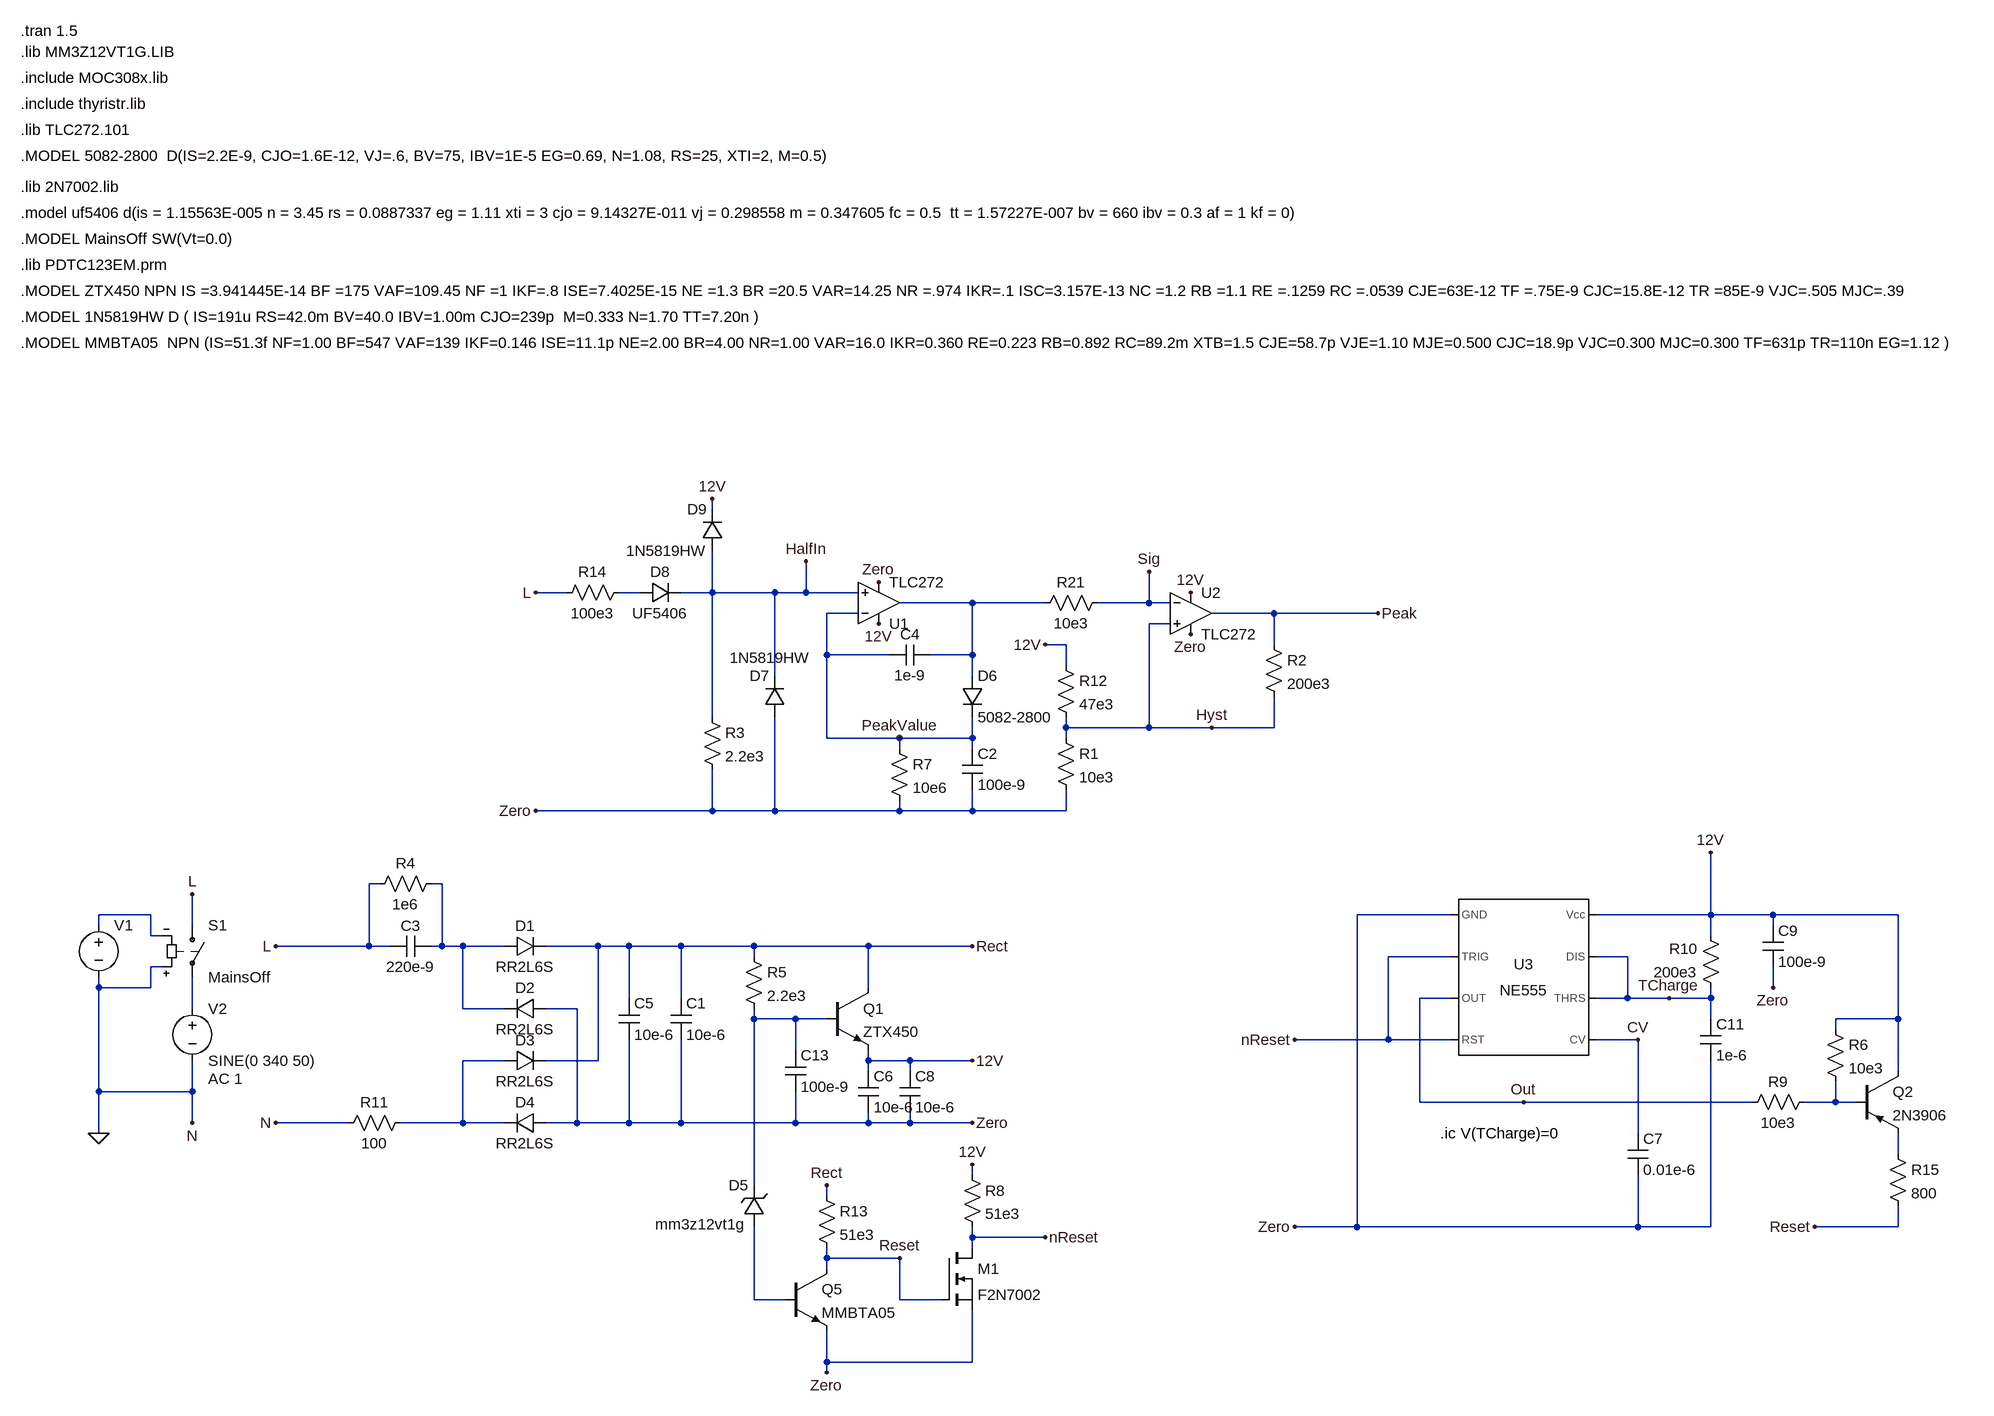
[diagram p0: schematic InrushTimer-3.asc]
InrushTimer-3.asc, the LTspice schematic file:
Version 4
SHEET 1 2412 1284
WIRE -1104 -656 -1104 -672
WIRE -1328 -528 -1376 -528
WIRE -1216 -528 -1248 -528
WIRE -1104 -528 -1104 -592
WIRE -1104 -528 -1152 -528
WIRE -1008 -528 -1104 -528
WIRE -960 -528 -960 -576
WIRE -960 -528 -1008 -528
WIRE -880 -528 -960 -528
WIRE -704 -512 -816 -512
WIRE -592 -512 -704 -512
WIRE -432 -512 -432 -560
WIRE -432 -512 -512 -512
WIRE -400 -512 -432 -512
WIRE -880 -496 -928 -496
WIRE -240 -496 -336 -496
WIRE -80 -496 -240 -496
WIRE -400 -480 -432 -480
WIRE -560 -448 -592 -448
WIRE -240 -448 -240 -496
WIRE -928 -432 -928 -496
WIRE -832 -432 -928 -432
WIRE -704 -432 -704 -512
WIRE -704 -432 -768 -432
WIRE -560 -416 -560 -448
WIRE -1008 -400 -1008 -528
WIRE -704 -400 -704 -432
WIRE -1104 -336 -1104 -528
WIRE -560 -320 -560 -336
WIRE -432 -320 -432 -480
WIRE -432 -320 -560 -320
WIRE -336 -320 -432 -320
WIRE -240 -320 -240 -368
WIRE -240 -320 -336 -320
WIRE -928 -304 -928 -432
WIRE -816 -304 -928 -304
WIRE -704 -304 -704 -336
WIRE -704 -304 -816 -304
WIRE -560 -304 -560 -320
WIRE -816 -288 -816 -304
WIRE -704 -288 -704 -304
WIRE -1104 -192 -1104 -256
WIRE -1104 -192 -1376 -192
WIRE -1008 -192 -1008 -336
WIRE -1008 -192 -1104 -192
WIRE -816 -192 -816 -208
WIRE -816 -192 -1008 -192
WIRE -704 -192 -704 -224
WIRE -704 -192 -816 -192
WIRE -560 -192 -560 -224
WIRE -560 -192 -704 -192
WIRE -1616 -80 -1632 -80
WIRE -1520 -80 -1536 -80
WIRE -1968 -32 -2048 -32
WIRE 32 -32 -112 -32
WIRE 432 -32 432 -128
WIRE 432 -32 256 -32
WIRE 528 -32 432 -32
WIRE 720 -32 528 -32
WIRE -2048 -16 -2048 -32
WIRE -1904 -16 -1904 -64
WIRE 528 -16 528 -32
WIRE -1968 0 -1968 -32
WIRE -1952 0 -1968 0
WIRE 432 0 432 -32
WIRE -1632 16 -1632 -80
WIRE -1632 16 -1776 16
WIRE -1600 16 -1632 16
WIRE -1520 16 -1520 -80
WIRE -1520 16 -1536 16
WIRE -1488 16 -1520 16
WIRE -1424 16 -1488 16
WIRE -1280 16 -1360 16
WIRE -1232 16 -1280 16
WIRE -1152 16 -1232 16
WIRE -1040 16 -1152 16
WIRE -864 16 -1040 16
WIRE -704 16 -864 16
WIRE -1040 32 -1040 16
WIRE 32 32 -64 32
WIRE 304 32 256 32
WIRE -1952 48 -1968 48
WIRE -2048 80 -2048 64
WIRE -1968 80 -1968 48
WIRE -1968 80 -2048 80
WIRE -864 80 -864 16
WIRE 528 80 528 48
WIRE -1232 96 -1232 16
WIRE -1152 96 -1152 16
WIRE 32 96 -16 96
WIRE 304 96 304 32
WIRE 304 96 256 96
WIRE 368 96 304 96
WIRE 432 96 432 80
WIRE 432 96 368 96
WIRE -1904 112 -1904 64
WIRE -1488 112 -1488 16
WIRE -1424 112 -1488 112
WIRE -1312 112 -1360 112
WIRE -1040 128 -1040 112
WIRE -976 128 -1040 128
WIRE -928 128 -976 128
WIRE 432 128 432 96
WIRE 720 128 720 -32
WIRE 720 128 624 128
WIRE 624 144 624 128
WIRE -64 160 -64 32
WIRE -64 160 -208 160
WIRE 32 160 -64 160
WIRE 320 160 256 160
WIRE -976 176 -976 128
WIRE -1424 192 -1488 192
WIRE -1280 192 -1280 16
WIRE -1280 192 -1360 192
WIRE -864 192 -864 176
WIRE -800 192 -864 192
WIRE -704 192 -800 192
WIRE -864 208 -864 192
WIRE -800 208 -800 192
WIRE 720 208 720 128
WIRE -2048 240 -2048 80
WIRE -1904 240 -1904 192
WIRE -1904 240 -2048 240
WIRE -16 256 -16 96
WIRE 144 256 -16 256
WIRE 496 256 144 256
WIRE 624 256 624 224
WIRE 624 256 576 256
WIRE 656 256 624 256
WIRE -1904 288 -1904 240
WIRE -1664 288 -1776 288
WIRE -1488 288 -1488 192
WIRE -1488 288 -1584 288
WIRE -1424 288 -1488 288
WIRE -1312 288 -1312 112
WIRE -1312 288 -1360 288
WIRE -1232 288 -1232 160
WIRE -1232 288 -1312 288
WIRE -1152 288 -1152 160
WIRE -1152 288 -1232 288
WIRE -976 288 -976 240
WIRE -976 288 -1152 288
WIRE -864 288 -864 272
WIRE -864 288 -976 288
WIRE -800 288 -800 272
WIRE -800 288 -864 288
WIRE -704 288 -800 288
WIRE -2048 304 -2048 240
WIRE 320 304 320 160
WIRE 720 336 720 304
WIRE -704 368 -704 352
WIRE -1040 384 -1040 128
WIRE -928 400 -928 384
WIRE -112 448 -112 -32
WIRE -112 448 -208 448
WIRE 320 448 320 368
WIRE 320 448 -112 448
WIRE 432 448 432 192
WIRE 432 448 320 448
WIRE 720 448 720 416
WIRE 720 448 592 448
WIRE -704 464 -704 448
WIRE -592 464 -704 464
WIRE -704 480 -704 464
WIRE -928 496 -928 480
WIRE -816 496 -928 496
WIRE -928 512 -928 496
WIRE -1040 560 -1040 448
WIRE -992 560 -1040 560
WIRE -816 560 -816 496
WIRE -752 560 -816 560
WIRE -928 656 -928 608
WIRE -704 656 -704 576
WIRE -704 656 -928 656
WIRE -928 672 -928 656
FLAG -1776 16 L
FLAG -1776 288 N
FLAG -1904 -64 L
FLAG -1904 288 N
FLAG -704 192 12V
FLAG -2048 304 0
FLAG -704 16 Rect
FLAG -704 288 Zero
FLAG -1376 -192 Zero
FLAG -960 -576 HalfIn
FLAG -848 -480 12V
FLAG -848 -544 Zero
FLAG -368 -528 12V
FLAG -368 -464 Zero
FLAG -1376 -528 L
FLAG -1104 -672 12V
FLAG -432 -560 Sig
FLAG -592 -448 12V
FLAG -80 -496 Peak
FLAG -336 -320 Hyst
FLAG -816 -304 PeakValue
FLAG -928 672 Zero
FLAG -928 384 Rect
FLAG -816 496 Reset
FLAG -592 464 nReset
FLAG -704 352 12V
FLAG -208 448 Zero
FLAG 432 -128 12V
FLAG 528 80 Zero
FLAG 368 96 TCharge
FLAG -208 160 nReset
FLAG 592 448 Reset
FLAG 320 160 CV
FLAG 144 256 Out
SYMBOL voltage -1904 96 R0
WINDOW 123 24 124 Left 2
WINDOW 39 0 0 Left 2
SYMATTR Value2 AC 1
SYMATTR InstName V2
SYMATTR Value SINE(0 340 50)
SYMBOL diode -1424 0 M90
WINDOW 0 0 32 VBottom 2
WINDOW 3 32 32 VTop 2
SYMATTR InstName D1
SYMATTR Value RR2L6S
SYMBOL diode -1424 176 M90
WINDOW 0 0 32 VBottom 2
WINDOW 3 32 32 VTop 2
SYMATTR InstName D3
SYMATTR Value RR2L6S
SYMBOL diode -1360 96 R90
WINDOW 0 0 32 VBottom 2
WINDOW 3 32 32 VTop 2
SYMATTR InstName D2
SYMATTR Value RR2L6S
SYMBOL diode -1360 272 R90
WINDOW 0 0 32 VBottom 2
WINDOW 3 32 32 VTop 2
SYMATTR InstName D4
SYMATTR Value RR2L6S
SYMBOL cap -1600 32 R270
WINDOW 0 32 32 VTop 2
WINDOW 3 0 32 VBottom 2
SYMATTR InstName C3
SYMATTR Value 220e-9
SYMBOL res -1632 -64 R270
WINDOW 0 32 56 VTop 2
WINDOW 3 0 56 VBottom 2
SYMATTR InstName R4
SYMATTR Value 1e6
SYMBOL zener -1024 448 R180
WINDOW 0 24 64 Left 2
WINDOW 3 29 4 Left 2
SYMATTR InstName D5
SYMATTR Value mm3z12vt1g
SYMATTR Prefix X
SYMBOL npn -928 80 R0
SYMATTR InstName Q1
SYMATTR Value ZTX450
SYMBOL res -1056 16 R0
SYMATTR InstName R5
SYMATTR Value 2.2e3
SYMBOL cap -1248 96 R0
SYMATTR InstName C5
SYMATTR Value 10e-6
SYMBOL cap -880 208 R0
SYMATTR InstName C6
SYMATTR Value 10e-6
SYMBOL cap -816 208 R0
SYMATTR InstName C8
SYMATTR Value 10e-6
SYMBOL res -1120 -352 R0
SYMATTR InstName R3
SYMATTR Value 2.2e3
SYMBOL cap -720 -288 R0
SYMATTR InstName C2
SYMATTR Value 100e-9
SYMBOL Opamps\\opamp2 -848 -448 M180
SYMATTR InstName U1
SYMATTR Value TLC272
SYMBOL Opamps\\opamp2 -368 -560 R0
SYMATTR InstName U2
SYMATTR Value TLC272
SYMBOL res -1680 304 R270
WINDOW 0 32 56 VTop 2
WINDOW 3 0 56 VBottom 2
SYMATTR InstName R11
SYMATTR Value 100
SYMBOL cap -1168 96 R0
SYMATTR InstName C1
SYMATTR Value 10e-6
SYMBOL diode -1216 -544 M90
WINDOW 0 0 32 VBottom 2
WINDOW 3 32 32 VTop 2
SYMATTR InstName D8
SYMATTR Value UF5406
SYMBOL res -1232 -544 R90
WINDOW 0 0 56 VBottom 2
WINDOW 3 32 56 VTop 2
SYMATTR InstName R14
SYMATTR Value 100e3
SYMBOL res -576 -432 R0
SYMATTR InstName R12
SYMATTR Value 47e3
SYMBOL res -576 -320 R0
SYMATTR InstName R1
SYMATTR Value 10e3
SYMBOL res -832 -304 R0
SYMATTR InstName R7
SYMATTR Value 10e6
SYMBOL cap -992 176 R0
SYMATTR InstName C13
SYMATTR Value 100e-9
SYMBOL sw -1904 -32 R0
SYMATTR InstName S1
SYMATTR Value MainsOff
SYMBOL voltage -2048 -32 R0
WINDOW 3 24 96 Invisible 2
WINDOW 123 0 0 Left 2
WINDOW 39 0 0 Left 2
SYMATTR Value PWL(0 -1 0.299 -1 0.300 1 0.349 1 0.350 -1 0.599 -1 .600 1 .649 1 .650 -1)
SYMATTR InstName V1
SYMBOL diode -720 -400 R0
SYMATTR InstName D6
SYMATTR Value 5082-2800
SYMBOL diode -1088 -592 R180
WINDOW 0 24 64 Left 2
WINDOW 3 24 0 Left 2
SYMATTR InstName D9
SYMATTR Value 1N5819HW
SYMBOL res -496 -528 R90
WINDOW 0 0 56 VBottom 2
WINDOW 3 32 56 VTop 2
SYMATTR InstName R21
SYMATTR Value 10e3
SYMBOL res -256 -464 R0
SYMATTR InstName R2
SYMATTR Value 200e3
SYMBOL cap -768 -448 R90
WINDOW 0 0 32 VBottom 2
WINDOW 3 32 32 VTop 2
SYMATTR InstName C4
SYMATTR Value 1e-9
SYMBOL diode -992 -336 R180
WINDOW 0 24 64 Left 2
WINDOW 3 -39 92 Left 2
SYMATTR InstName D7
SYMATTR Value 1N5819HW
SYMBOL npn -992 512 R0
SYMATTR InstName Q5
SYMATTR Value MMBTA05
SYMBOL res -944 384 R0
SYMATTR InstName R13
SYMATTR Value 51e3
SYMBOL nmos -752 480 R0
SYMATTR InstName M1
SYMATTR Value F2N7002
SYMATTR Prefix X
SYMBOL res -720 352 R0
SYMATTR InstName R8
SYMATTR Value 51e3
SYMBOL Misc\\NE555 144 64 R0
SYMATTR InstName U3
SYMBOL cap 304 304 R0
SYMATTR InstName C7
SYMATTR Value 0.01e-6
SYMATTR SpiceLine V=16
SYMBOL cap 512 -16 R0
SYMATTR InstName C9
SYMATTR Value 100e-9
SYMBOL res 448 96 R180
WINDOW 0 36 76 Left 2
WINDOW 3 36 40 Left 2
SYMATTR InstName R10
SYMATTR Value 200e3
SYMBOL cap 416 128 R0
SYMATTR InstName C11
SYMATTR Value 1e-6
SYMBOL res 704 320 R0
SYMATTR InstName R15
SYMATTR Value 800
SYMBOL pnp 656 208 R0
SYMATTR InstName Q2
SYMATTR Value 2N3906
SYMBOL res 608 128 R0
SYMATTR InstName R6
SYMATTR Value 10e3
SYMBOL res 480 272 R270
WINDOW 0 32 56 VTop 2
WINDOW 3 0 56 VBottom 2
SYMATTR InstName R9
SYMATTR Value 10e3
TEXT -2168 -992 Left 2 !.MODEL ZTX450 NPN IS =3.941445E-14 BF =175 VAF=109.45 NF =1 IKF=.8 ISE=7.4025E-15 NE =1.3 BR =20.5 VAR=14.25 NR =.974 IKR=.1 ISC=3.157E-13 NC =1.2 RB =1.1 RE =.1259 RC =.0539 CJE=63E-12 TF =.75E-9 CJC=15.8E-12 TR =85E-9 VJC=.505 MJC=.39
TEXT -2168 -1360 Left 2 !.lib MM3Z12VT1G.LIB
TEXT -2168 -1320 Left 2 !.include MOC308x.lib
TEXT -2168 -1280 Left 2 !.include thyristr.lib
TEXT -2168 -1240 Left 2 !.lib TLC272.101
TEXT -2168 -1200 Left 2 !.MODEL 5082-2800  D(IS=2.2E-9, CJO=1.6E-12, VJ=.6, BV=75, IBV=1E-5 EG=0.69, N=1.08, RS=25, XTI=2, M=0.5)
TEXT -2168 -1152 Left 2 !.lib 2N7002.lib
TEXT -2168 -1112 Left 2 !.model uf5406 d(is = 1.15563E-005 n = 3.45 rs = 0.0887337 eg = 1.11 xti = 3 cjo = 9.14327E-011 vj = 0.298558 m = 0.347605 fc = 0.5  tt = 1.57227E-007 bv = 660 ibv = 0.3 af = 1 kf = 0)
TEXT -2168 -1072 Left 2 !.MODEL MainsOff SW(Vt=0.0)
TEXT -2168 -1032 Left 2 !.lib PDTC123EM.prm
TEXT -2168 -952 Left 2 !.MODEL 1N5819HW D ( IS=191u RS=42.0m BV=40.0 IBV=1.00m CJO=239p  M=0.333 N=1.70 TT=7.20n )
TEXT -2168 -1392 Left 2 !.tran 1.5
TEXT -2168 -912 Left 2 !.MODEL MMBTA05  NPN (IS=51.3f NF=1.00 BF=547 VAF=139 IKF=0.146 ISE=11.1p NE=2.00 BR=4.00 NR=1.00 VAR=16.0 IKR=0.360 RE=0.223 RB=0.892 RC=89.2m XTB=1.5 CJE=58.7p VJE=1.10 MJE=0.500 CJC=18.9p VJC=0.300 MJC=0.300 TF=631p TR=110n EG=1.12 )
TEXT 16 304 Left 2 !.ic V(TCharge)=0

The netlist it stands for:
* InrushTimer-3.asc
V2 N005 0 SINE(0 340 50) AC 1
D1 N003 Rect RR2L6S
D3 N007 Rect RR2L6S
D2 Zero N003 RR2L6S
D4 Zero N007 RR2L6S
C3 L N003 220e-9
R4 L N003 1e6
XD5 N010 N006 mm3z12vt1g  ; pins + -
Q1 Rect N006 12V 0 ZTX450
R5 Rect N006 2.2e3
C5 Rect Zero 10e-6
C6 12V Zero 10e-6
C8 12V Zero 10e-6
R3 HalfIn Zero 2.2e3
C2 PeakValue Zero 100e-9
XU1 HalfIn PeakValue 12V Zero N002 TLC272  ; pins In+ In- V+ V- OUT
XU2 Hyst Sig 12V Zero Peak TLC272  ; pins In+ In- V+ V- OUT
R11 0 N007 100
C1 Rect Zero 10e-6
D8 N001 HalfIn UF5406
R14 N001 L 100e3
R12 12V Hyst 47e3
R1 Hyst Zero 10e3
R7 PeakValue Zero 10e6
C13 N006 Zero 100e-9
S1 L N005 0 N004 MainsOff
V1 N004 0 PWL(0 -1 0.299 -1 0.300 1 0.349 1 0.350 -1 0.599 -1 .600 1 .649 1 .650 -1)
D6 N002 PeakValue 5082-2800
D9 HalfIn 12V 1N5819HW
R21 Sig N002 10e3
R2 Peak Hyst 200e3
C4 N002 PeakValue 1e-9
D7 Zero HalfIn 1N5819HW
Q5 Reset N010 Zero 0 MMBTA05
R13 Rect Reset 51e3
XM1 nReset Reset Zero F2N7002  ; pins D G S
R8 12V nReset 51e3
XU3 Zero nReset Out nReset CV TCharge TCharge 12V NE555  ; pins GND TRIG OUT RST CV THRS DIS Vcc
C7 CV Zero 0.01e-6 V=16
C9 12V Zero 100e-9
R10 TCharge 12V 200e3
C11 TCharge Zero 1e-6
R15 N009 Reset 800
Q2 12V N008 N009 0 2N3906
R6 12V N008 10e3
R9 Out N008 10e3
.model D D
.lib standard.dio
.model NPN NPN
.model PNP PNP
.lib standard.bjt
.MODEL ZTX450 NPN IS =3.941445E-14 BF =175 VAF=109.45 NF =1 IKF=.8 ISE=7.4025E-15 NE =1.3 BR =20.5 VAR=14.25 NR =.974 IKR=.1 ISC=3.157E-13 NC =1.2 RB =1.1 RE =.1259 RC =.0539 CJE=63E-12 TF =.75E-9 CJC=15.8E-12 TR =85E-9 VJC=.505 MJC=.39
.lib MM3Z12VT1G.LIB
.include MOC308x.lib
.include thyristr.lib
.lib TLC272.101
.MODEL 5082-2800  D(IS=2.2E-9, CJO=1.6E-12, VJ=.6, BV=75, IBV=1E-5 EG=0.69, N=1.08, RS=25, XTI=2, M=0.5)
.lib 2N7002.lib
.model uf5406 d(is = 1.15563E-005 n = 3.45 rs = 0.0887337 eg = 1.11 xti = 3 cjo = 9.14327E-011 vj = 0.298558 m = 0.347605 fc = 0.5  tt = 1.57227E-007 bv = 660 ibv = 0.3 af = 1 kf = 0)
.MODEL MainsOff SW(Vt=0.0)
.lib PDTC123EM.prm
.MODEL 1N5819HW D ( IS=191u RS=42.0m BV=40.0 IBV=1.00m CJO=239p  M=0.333 N=1.70 TT=7.20n )
.tran 1.5
.MODEL MMBTA05  NPN (IS=51.3f NF=1.00 BF=547 VAF=139 IKF=0.146 ISE=11.1p NE=2.00 BR=4.00 NR=1.00 VAR=16.0 IKR=0.360 RE=0.223 RB=0.892 RC=89.2m XTB=1.5 CJE=58.7p VJE=1.10 MJE=0.500 CJC=18.9p VJC=0.300 MJC=0.300 TF=631p TR=110n EG=1.12 )
.ic V(TCharge)=0
.lib NE555.sub
.backanno
.end